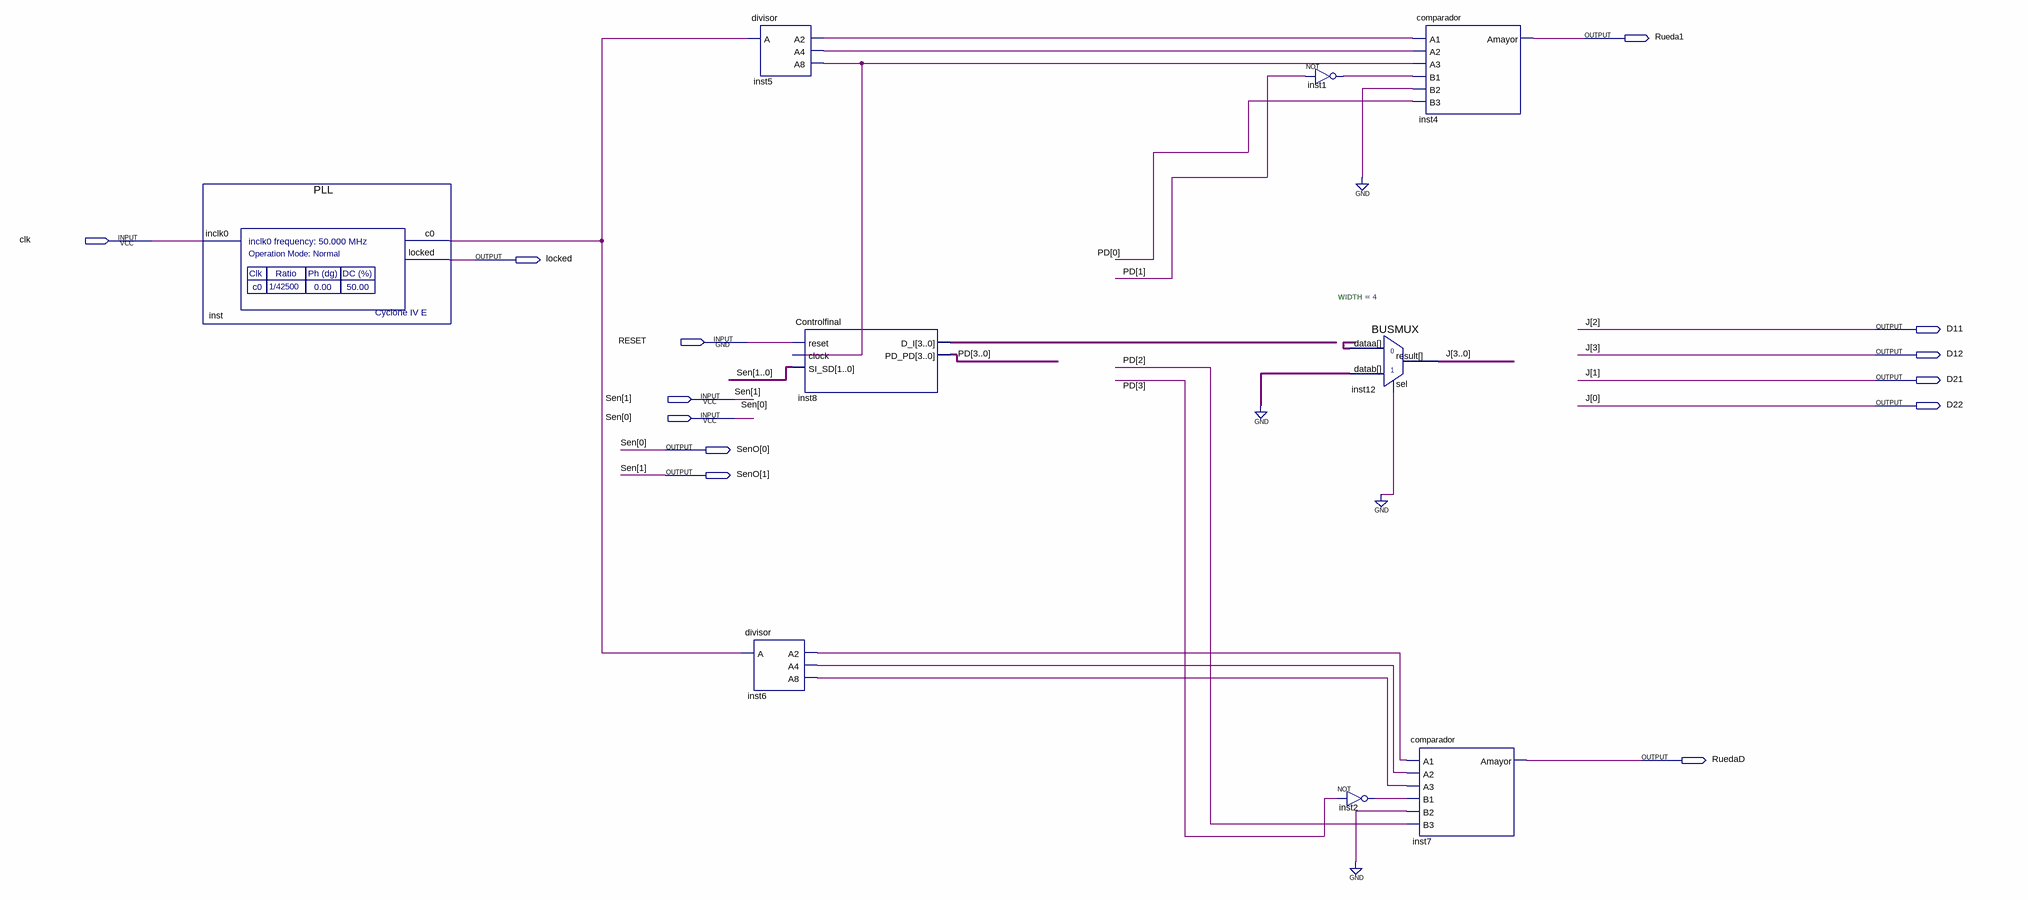
[diagram p0: schematic sheet]
// Quartus schematic TyDD.bdf as structural Verilog: 9 symbols, 13 pins
module TyDD (
  input  clk,
  input  RESET,
  input  [1:0] Sen,
  output Rueda1,
  output locked,
  output D11,
  output D12,
  output D21,
  output D22,
  output [1:0] SenO,
  output RuedaD
);

  wire inst1_out, inst2_out, inst5_a2, inst5_a4, inst5_a8, inst6_a2, inst6_a4, inst6_a8, inst_c0;
  wire [3:0] inst8_d_i, PD, undriven;

  PLL inst (.inclk0(clk), .c0(inst_c0), .locked(locked));
  divisor inst5 (.A(inst_c0), .A2(inst5_a2), .A4(inst5_a4), .A8(inst5_a8));
  divisor inst6 (.A(inst_c0), .A2(inst6_a2), .A4(inst6_a4), .A8(inst6_a8));
  Controlfinal inst8 (.reset(RESET), .clock(inst5_a8), .SI_SD(Sen), .D_I(inst8_d_i), .PD_PD(PD));
  not inst1 (inst1_out, PD[1]);
  BUSMUX #(.WIDTH(4)) inst12 (.datab(4'b0000), .sel(1'b0), .dataa(undriven), .result({D12, D11, D21, D22}));
  not inst2 (inst2_out, PD[3]);
  comparador inst7 (
    .A1(inst6_a2), .A2(inst6_a4), .A3(inst6_a8), .B1(inst2_out), .B2(1'b0), .B3(PD[2]), .Amayor(RuedaD));
  comparador inst4 (
    .A1(inst5_a2), .A2(inst5_a4), .A3(inst5_a8), .B1(inst1_out), .B2(1'b0), .B3(PD[0]), .Amayor(Rueda1));

  assign SenO = Sen;

  // Other names for the same wires on the sheet: J[3:0] = {D12, D11, D21, D22}
endmodule
